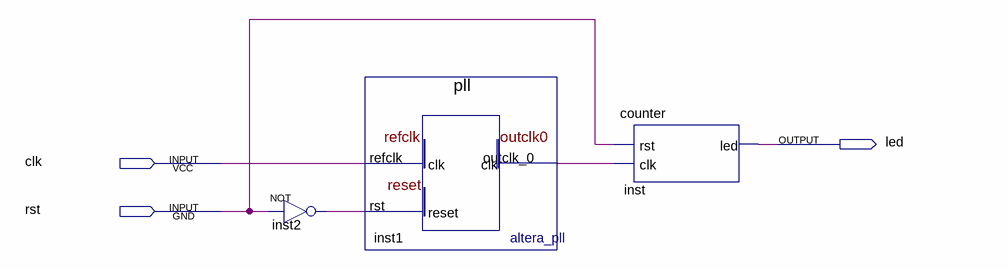
[diagram p0: schematic sheet]
// Quartus schematic first_de-10_project.bdf as structural Verilog: 3 symbols, 3 pins
module \first_de-10_project  (
  input  clk,
  input  rst,
  output led
);

  wire inst1_outclk_0, inst2_out;

  not inst2 (inst2_out, rst);
  pll inst1 (.refclk(clk), .rst(inst2_out), .outclk_0(inst1_outclk_0));
  counter inst (.rst(rst), .clk(inst1_outclk_0), .led(led));
endmodule
